# EAGLE design tmc2130-driver-arduino-shield-v3 (EAGLE 9.2.0)
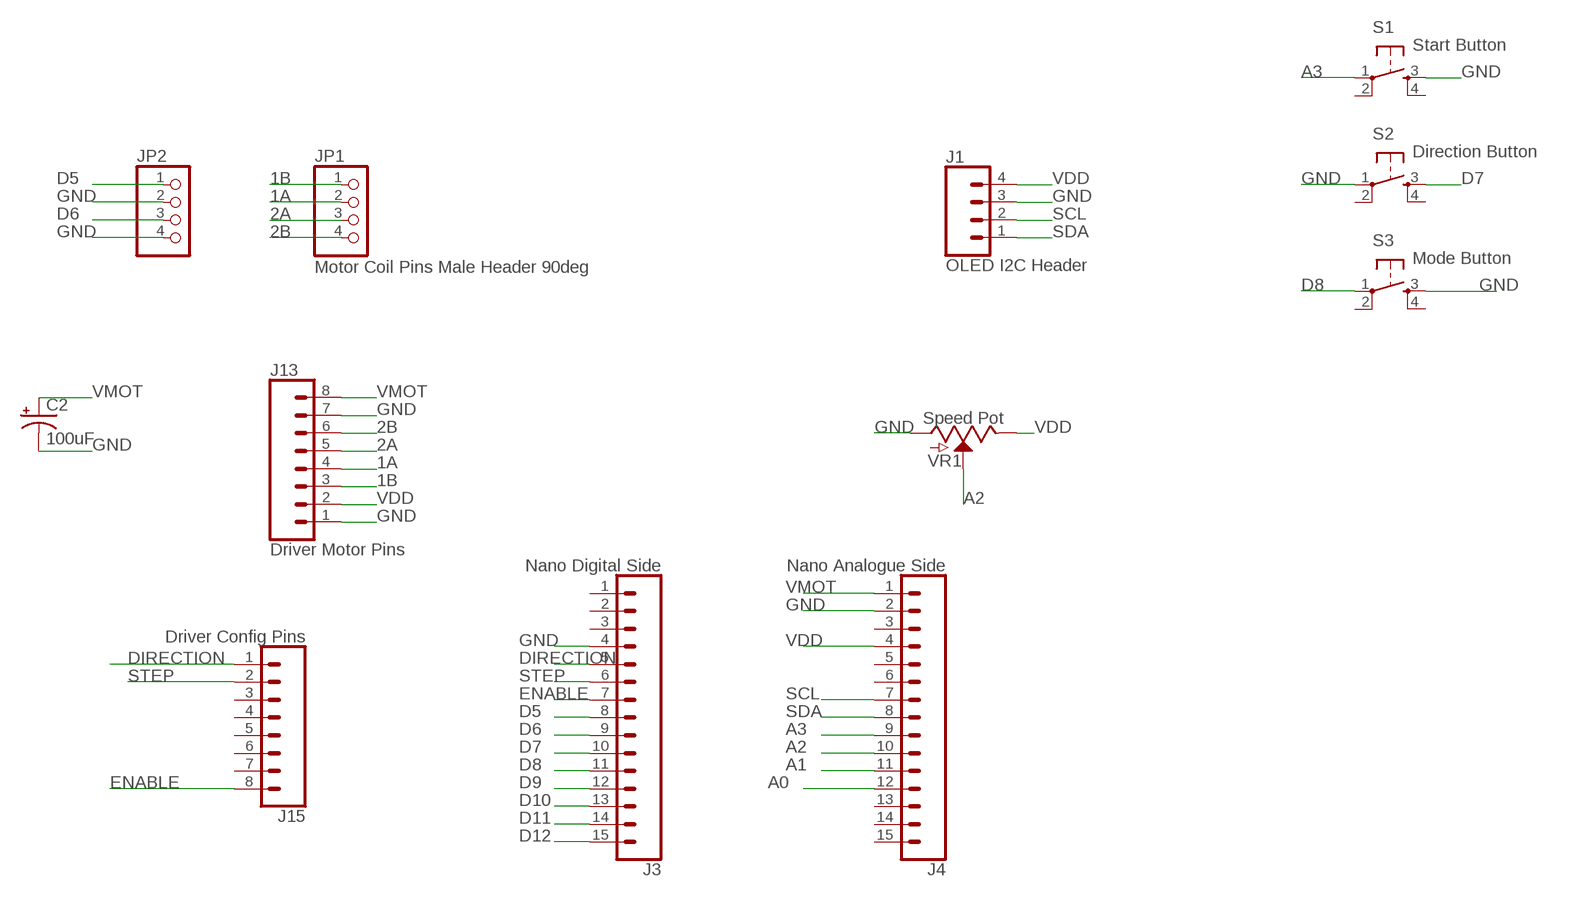
[diagram p0: schematic, sheet 1]

## Parts
C2  100uF  100UF-POLAR-RADIAL-2.5MM-25V-20%  [CPOL-RADIAL-2.5MM-6.5MM]
J1  OLED I2C Header  CONN_04LONGPADS  [1X04_LONGPADS]
J3  Nano Digital Side  CONN_15  [1X15]
J4  Nano Analogue Side  CONN_15  [1X15]
J13  Driver Motor Pins  CONN_08LONGPADS  [1X08_LONGPADS]
J15  Driver Config Pins  CONN_08LONGPADS  [1X08_LONGPADS]
JP1  Motor Coil Pins Male Header 90deg  PINHD-1X4/90  [1X04/90]
JP2  PINHD-1X4/90  [1X04/90]
S1  Start Button  6MM_SWITCH6MM_SWITCH  [6MM_SWITCH]
S2  Direction Button  6MM_SWITCH6MM_SWITCH  [6MM_SWITCH]
S3  Mode Button  6MM_SWITCH6MM_SWITCH  [6MM_SWITCH]
VR1  Speed Pot  POTENTIOMETER-PTH-9MM-1/20W-20%  [POT-PTH-ALPS]

## Nets
1A: J13.4 JP1.2
1B: J13.3 JP1.1
2A: J13.5 JP1.3
2B: J13.6 JP1.4
A0: J4.12
A1: J4.11
A2: J4.10 VR1.P$2(S)
A3: J4.9 S1.1(P)
D5: J3.8 JP2.1
D6: J3.9 JP2.3
D7: J3.10 S2.3(S)
D8: J3.11 S3.1(P)
D9: J3.12
D10: J3.13
D11: J3.14
D12: J3.15
DIRECTION: J3.5 J15.1
ENABLE: J3.7 J15.8
GND: C2.2(-) J1.3 J3.4 J4.2 J13.1 J13.7 JP2.2 JP2.4 S1.3(S) S2.1(P) S3.3(S) VR1.P$3(A)
SCL: J1.2 J4.7
SDA: J1.1 J4.8
STEP: J3.6 J15.2
VDD: J1.4 J4.4 J13.2 VR1.P$1(E)
VMOT: C2.1(+) J4.1 J13.8
Unconnected: J3.1 J3.2 J3.3 J4.3 J4.5 J4.6 J4.13 J4.14 J4.15 J15.3 J15.4 J15.5 J15.6 J15.7 S1.2(P1) S1.4(S1) S2.2(P1) S2.4(S1) S3.2(P1) S3.4(S1)

## Library data of the parts
C2 = SparkFun-Capacitors:100UF-POLAR: 100µF polarized capacitors A capacitor is a passive two-terminal electrical component used to store electrical energy temporarily in an electric field.; PROD_ID: CAP-08439
J1 = SparkFun-Connectors:CONN_04: Multi connection point. Often used as Generic Header-pin footprint for 0.1 inch spaced/style header connections On any of the 0.1 inch spaced packages, you can populate with these: Break Away Headers - Straight <https://www.sparkfun.com/products/116> (PRT-00116) Break Away Male Headers - Right Angle <https://www.sparkfun.com/products/553> (PRT-00553) Female Headers <https://www.sparkfun.com/products/115> (PRT-00115) Break Away Headers - Machine Pin <https://www.sparkfun.com/products/117> (PRT-00117) Break Away Female Headers - Swiss Machine Pin <https://www.sparkfun.com/products/743> (PRT-00743) For SCREWTERMINALS and SPRING TERMINALS visit here: Screw Terimnals on SparkFun.com <https://www.sparkfun.com/search/results?term=Screw+Terminals> (5mm/3.5mm/2.54mm spacing) This device is also useful as a general connection point to wire up your design to another part of your project. Our various solder wires solder well into these plated through hole pads. Hook-Up Wire - Assortment (Stranded, 22 AWG) <https://www.sparkfun.com/products/11375> (PRT-11375) Hook-Up Wire - Assortment (Solid Core, 22 AWG) <https://www.sparkfun.com/products/11367> (PRT-11367) View the entire wire category on our website here <https://www.sparkfun.com/categories/141> Special notes: Molex polarized connector foot print use with SKU : PRT-08231 with associated crimp pins and housings. 1MM SMD Version SKU: PRT-10208; PROD_ID: CONN-09696
J3 J4 = SparkFun-Connectors:CONN_15: Multi connection point. Often used as Generic Header-pin footprint for 0.1 inch spaced/style header connections On any of the 0.1 inch spaced packages, you can populate with these: Break Away Headers - Straight <https://www.sparkfun.com/products/116> (PRT-00116) Break Away Male Headers - Right Angle <https://www.sparkfun.com/products/553> (PRT-00553) Female Headers <https://www.sparkfun.com/products/115> (PRT-00115) Break Away Headers - Machine Pin <https://www.sparkfun.com/products/117> (PRT-00117) Break Away Female Headers - Swiss Machine Pin <https://www.sparkfun.com/products/743> (PRT-00743) For SCREWTERMINALS and SPRING TERMINALS visit here: Screw Terimnals on SparkFun.com <https://www.sparkfun.com/search/results?term=Screw+Terminals> (5mm/3.5mm/2.54mm spacing) This device is also useful as a general connection point to wire up your design to another part of your project. Our various solder wires solder well into these plated through hole pads. Hook-Up Wire - Assortment (Stranded, 22 AWG) <https://www.sparkfun.com/products/11375> (PRT-11375) Hook-Up Wire - Assortment (Solid Core, 22 AWG) <https://www.sparkfun.com/products/11367> (PRT-11367) View the entire wire category on our website here <https://www.sparkfun.com/categories/141> Special notes: Molex polarized connector foot print use with SKU : PRT-08231 with associated crimp pins and housings. 1MM SMD Version SKU: PRT-10208 NOTES ON THE VARIANTS LOCK and LOCK_LONGPADS... This footprint was designed to help hold the alignment of a through-hole component (i.e. 6-pin header) while soldering it into place. You may notice that each hole has been shifted either up or down by 0.005 of an inch from it's more standard position (which is a perfectly straight line). This slight alteration caused the pins (the squares in the middle) to touch the edges of the holes. Because they are alternating, it causes a "brace" to hold the component in place. 0.005 has proven to be the perfect amount of "off-center" position when using our standard breakaway headers. Although looks a little odd when you look at the bare footprint, once you have a header in there, the alteration is very hard to notice. Also,if you push a header all the way into place, it is covered up entirely on the bottom side.
J13 J15 = SparkFun-Connectors:CONN_08: Multi connection point. Often used as Generic Header-pin footprint for 0.1 inch spaced/style header connections On any of the 0.1 inch spaced packages, you can populate with these: Break Away Headers - Straight <https://www.sparkfun.com/products/116> (PRT-00116) Break Away Male Headers - Right Angle <https://www.sparkfun.com/products/553> (PRT-00553) Female Headers <https://www.sparkfun.com/products/115> (PRT-00115) Break Away Headers - Machine Pin <https://www.sparkfun.com/products/117> (PRT-00117) Break Away Female Headers - Swiss Machine Pin <https://www.sparkfun.com/products/743> (PRT-00743) Arduino Stackable Header - 8 Pin <https://www.sparkfun.com/products/9279> (PRT-09279) For SCREWTERMINALS and SPRING TERMINALS visit here: Screw Terimnals on SparkFun.com <https://www.sparkfun.com/search/results?term=Screw+Terminals> (5mm/3.5mm/2.54mm spacing) This device is also useful as a general connection point to wire up your design to another part of your project. Our various solder wires solder well into these plated through hole pads. Hook-Up Wire - Assortment (Stranded, 22 AWG) <https://www.sparkfun.com/products/11375> (PRT-11375) Hook-Up Wire - Assortment (Solid Core, 22 AWG) <https://www.sparkfun.com/products/11367> (PRT-11367) View the entire wire category on our website here <https://www.sparkfun.com/categories/141> Special notes: Molex polarized connector foot print use with SKU : PRT-08231 with associated crimp pins and housings. 1MM SMD Version SKU: PRT-10208 NOTES ON THE VARIANTS LOCK and LOCK_LONGPADS... This footprint was designed to help hold the alignment of a through-hole component (i.e. 6-pin header) while soldering it into place. You may notice that each hole has been shifted either up or down by 0.005 of an inch from it's more standard position (which is a perfectly straight line). This slight alteration caused the pins (the squares in the middle) to touch the edges of the holes. Because they are alternating, it causes a "brace" to hold the component in place. 0.005 has proven to be the perfect amount of "off-center" position when using our standard breakaway headers. Although looks a little odd when you look at the bare footprint, once you have a header in there, the alteration is very hard to notice. Also,if you push a header all the way into place, it is covered up entirely on the bottom side.
JP1 JP2 = pinhead:PINHD-1X4: PIN HEADER
S1-S3 = fab:6MM_SWITCH: OMRON SWITCH
VR1 = SparkFun-Resistors:POTENTIOMETER: Potentiometer (Pot) Three-terminal potentiometers, with an adjustable wiper and two adjustable resistors. A pot can be used to create a configurable voltage divider, or as a variable resistor. Variants ALPS_POT and ALPS_POT_KIT - PTH, breadboard compatible, 9mm square pots Rotary Potentiometer - Linear (10k ohm) <https://www.sparkfun.com/products/9288> (COM-09288) The KIT variant exposes copper on only one side of the PTH pad, so the part can only be assembled on one side of the PCB. Useful for beginner soldering kits.; PROD_ID: RES-09177; SF_SKU: COM-09288; VALUE: 10k

## Board
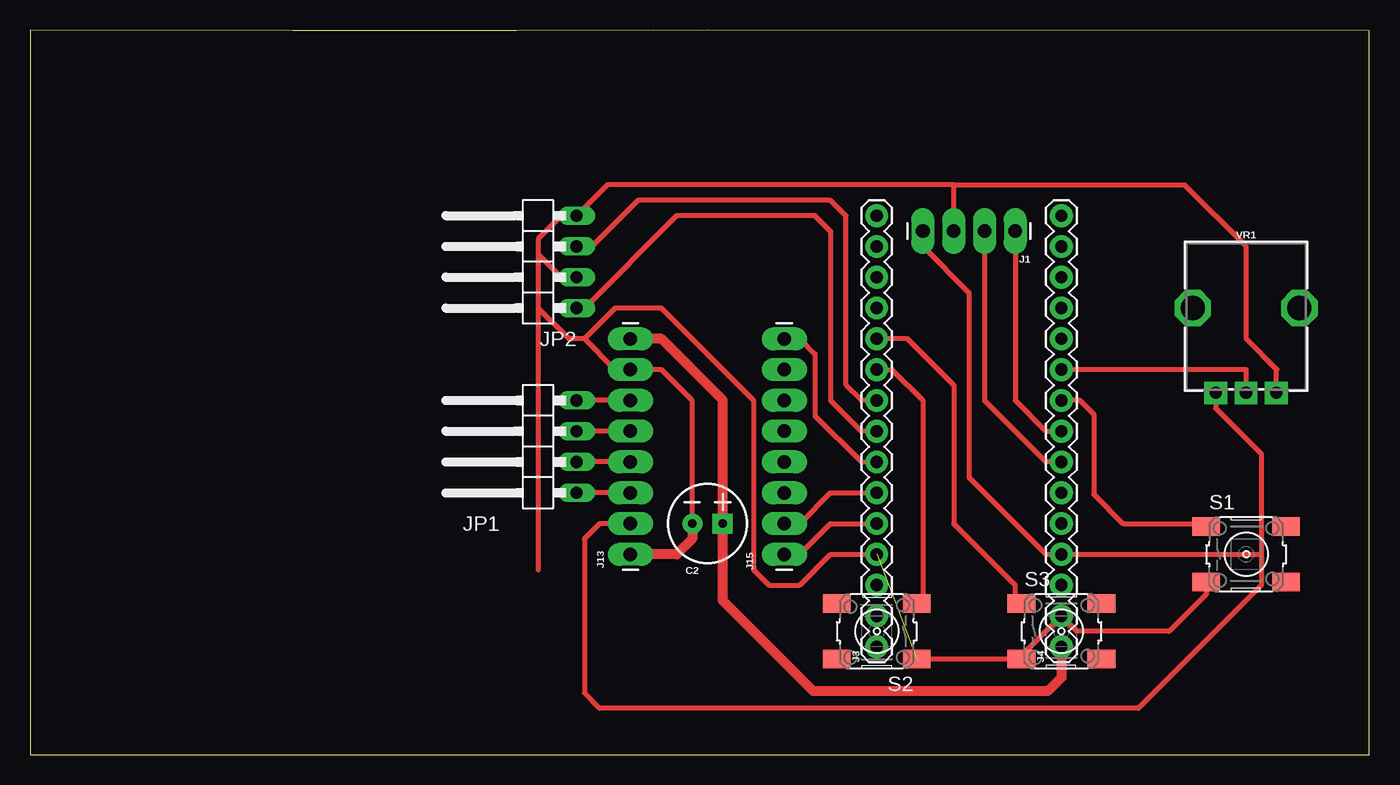
[diagram p1: board, top side]

Size 110.49 x 59.74 mm. Coordinates in mm from the lower left corner, seen from the top.
Outline: 0,0 110.49,0 110.49,59.69 55.83,59.74 55.25,59.69 51.41,59.74 40.13,59.69 21.64,59.69 0,59.74 0,0
Copper layers (1*16): Top 0.035mm / dielectric 1.5mm / Bottom 0.035mm
Design rules "default": minimum track width 6mil, minimum drill 0.35mm, track to track 6mil, track to pad 6mil, pad to pad 6mil, via to via 6mil, smd to smd 6mil, copper to edge 40mil, drill to drill 6mil, minimum pad ring 10mil, minimum via ring 8mil, stop-mask expansion 4mil, vias tented up to drill 0mil, thermal gap 10mil

### Footprints (pad centres in the part's own frame; a part is rotated, then mirrored left to right if it is on the bottom)
CPOL-RADIAL-2.5MM-6.5MM = drill 0.7 pad 1.651 square: 1 1.25,0 | drill 0.7 pad 1.651: 2 -1.25,0
1X04_LONGPADS = drill 1.118 pad 1.88 long: 1 0,0; 2 2.54,0; 3 5.08,0; 4 7.62,0
1X15 = drill 1.016 pad 1.88: 1 0,0; 2 2.54,0; 3 5.08,0; 4 7.62,0; 5 10.16,0; 6 12.7,0; 7 15.24,0; 8 17.78,0; 9 20.32,0; 10 22.86,0; 11 25.4,0; 12 27.94,0; 13 30.48,0; 14 33.02,0; 15 35.56,0
1X08_LONGPADS = drill 1.118 pad 1.88 long: 1 0,0; 2 2.54,0; 3 5.08,0; 4 7.62,0; 5 10.16,0; 6 12.7,0; 7 15.24,0; 8 17.78,0
1X04/90 = drill 1.016 long: 1 -3.81,-3.81; 2 -1.27,-3.81; 3 1.27,-3.81; 4 3.81,-3.81
6MM_SWITCH = smd 2.286 x 1.524: 1 -3.302,2.286; 2 3.302,2.286; 3 -3.302,-2.286; 4 3.302,-2.286
POT-PTH-ALPS = drill 1 pad 1.88 square: P$1 7,-2.5; P$2 7,0; P$3 7,2.5 | drill 2 octagon: P$4 0,-4.4; P$5 0,4.4

### Placement (x,y rotation side)
C2  55.88,19.05 0 top
J1  81.28,43.18 180 top
J3  69.85,8.89 90 top
J4  85.09,8.89 90 top
J13  49.53,16.51 90 top
J15  62.23,16.51 90 top
JP1  41.27,25.4 90 top
JP2  41.27,40.64 90 top
S1  100.33,16.51 0 top
S2  69.85,10.16 180 top
S3  85.09,10.16 0 top
VR1  100.33,36.83 270 top

### Tracks (layer width: path | path; a pad name or v marks a point on that pad's centre or on a via)
1A
  Top 0.406: J13.4 JP1.2
1B
  Top 0.406: J13.3 JP1.1
2A
  Top 0.406: J13.5 JP1.3
2B
  Top 0.406: J13.6 JP1.4
A2
  Top 0.406: 88.9,31.75 J4.10 100.33,31.75 VR1.P$2
A3
  Top 0.406: J4.9 86.61,29.21 87.76,28.07 87.76,21.46 90.17,19.05 96.77,19.05 S1.1
D5
  Top 0.406: J3.8 68.58,26.67 66.04,29.21 66.04,43.18 64.77,44.45 53.34,44.45 45.72,36.83 JP2.1
D6
  Top 0.406: JP2.3 46.35,41.91 50.16,45.72 66.04,45.72 67.31,44.45 67.31,30.48 68.58,29.21 J3.9
D7
  Top 0.406: J3.10 71.12,31.75 73.66,29.21 73.66,12.95 S2.3
D8
  Top 0.406: S3.1 81.28,12.95 81.28,13.97 76.2,19.05 76.2,30.48 72.39,34.29 J3.11
DIRECTION
  Top 0.406: J15.1 63.5,16.51 66.04,19.05 J3.5
ENABLE
  Top 0.406: J15.8 63.5,34.29 64.77,33.02 64.77,27.94 68.58,24.13 J3.7
GND  (1 unrouted)
  Top 0.406: C2.2 54.61,19.07 54.61,29.21 52.07,31.75 J13.7 48.26,31.75 45.72,34.29 | 41.91,41.27 41.91,42.55 43.81,44.45 JP2.4 47.62,46.99 76.2,46.99 | JP2.2 43.81,39.37 41.91,41.27 | J3.4 66.04,16.51 63.5,13.97 60.96,13.97 59.69,15.24 59.69,29.21 52.07,36.83 48.26,36.83 45.72,34.29 | J1.3 76.2,46.99 | S1.3 97.03,13.21 93.98,10.16 86.36,10.16 J4.2 81.79,8.13 S3.3 S2.1 | VR1.P$3 102.83,31.71 102.87,31.75 100.33,34.29 100.33,41.91 95.25,46.99 76.2,46.99 | 41.91,41.27 41.91,36.83 | 45.72,34.29 44.45,34.29 41.91,36.83 | 41.91,36.83 41.91,15.24
  Top 0.813: J13.1 53.34,16.51 54.63,17.8 C2.2
SCL
  Top 0.406: J4.7 83.82,24.13 78.74,29.21 J1.2
SDA
  Top 0.406: J1.1 81.28,29.21 83.82,26.67 J4.8
STEP
  Top 0.406: J15.2 63.5,19.05 66.04,21.59 J3.6
VDD
  Top 0.406: J13.2 46.99,19.05 45.72,17.78 45.72,5.08 46.99,3.81 91.44,3.81 101.6,13.97 101.6,16.51 | J1.4 73.66,41.91 77.47,38.1 77.47,22.86 83.82,16.51 J4.4 101.6,16.51 | VR1.P$1 97.83,28.56 101.6,24.79 101.6,16.51
VMOT
  Top 0.813: J13.8 52.07,34.29 57.15,29.21 57.13,29.19 C2.1 57.13,12.72 64.62,5.23 83.97,5.23 85.09,6.35 J4.1